# EAGLE design FT232_USB_UART_power (EAGLE 8.2.0)
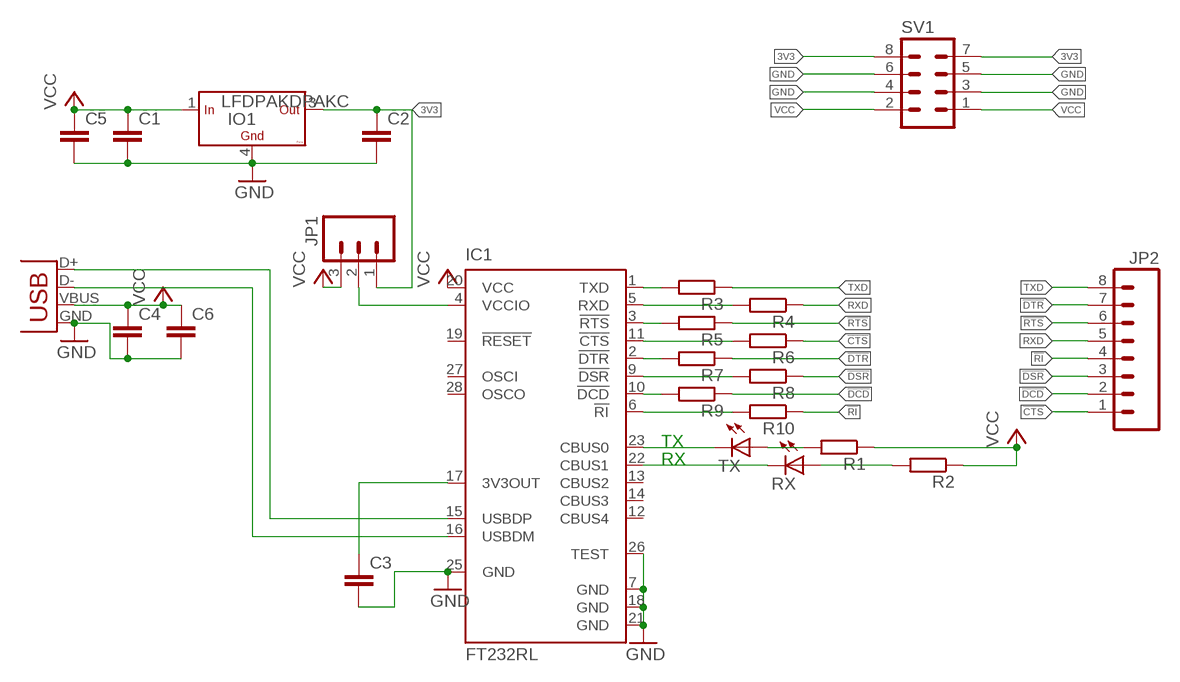
[diagram p0: schematic, sheet 1]

## Parts
C1  C-EUC0805  [C0805]
C2  C-EUC0805  [C0805]
C3  C-EUC0805  [C0805]
C4  C-EUC0805  [C0805]
C5  C-EUC0805  [C0805]
C6  C-EUC0805  [C0805]
IC1  FT232RL  [SSOP28]
IO1  LFDPAKDPAKC  [DPAK]
JP1  M03LONGPADS  [1X03_LONGPADS]
JP2  M08LONGPADS  [1X08_LONGPADS]
R1  R-EU_M0805  [M0805]
R2  R-EU_M0805  [M0805]
R3  R-EU_M0805  [M0805]
R4  R-EU_M0805  [M0805]
R5  R-EU_M0805  [M0805]
R6  R-EU_M0805  [M0805]
R7  R-EU_M0805  [M0805]
R8  R-EU_M0805  [M0805]
R9  R-EU_M0805  [M0805]
R10  R-EU_M0805  [M0805]
RX  LEDSML0805  [SML0805]
SV1  MA04-2  [MA04-2]
TX  LEDSML0805  [SML0805]
X1  USB-SMD-NS  [USB-MINIB-NOSTOP]

## Nets
3V3: C2.1 IO1.3(OUT) JP1.1 SV1.7 SV1.8
!CTS: JP2.1 R6.1
!DCD: JP2.2 R9.1
!DSR: JP2.3 R8.1
!DTR: JP2.7 R7.1
!RI: JP2.4 R10.1
!RTS: JP2.6 R5.1
GND: C1.2 C2.2 C3.2 C4.2 C5.2 C6.2 IC1.7(GND) IC1.18(GND) IC1.21(GND) IC1.25(GND) IC1.26(TEST) IO1.4(GND) SV1.3 SV1.4 SV1.5 SV1.6 X1.GND
N$1: IC1.15(USBDP) X1.D+
N$2: IC1.16(USBDM) X1.D-
N$3: IC1.23(CBUS0) TX.C
N$4: R1.2 TX.A
N$6: C3.1 IC1.17(3V3OUT)
N$7: IC1.4(VCCIO) JP1.2
N$8: R2.2 RX.A
N$9: IC1.22(CBUS1) RX.C
N$10: IC1.1(TXD) R3.2
N$11: IC1.5(RXD) R4.2
N$12: IC1.3(!RTS) R5.2
N$13: IC1.11(!CTS) R6.2
N$14: IC1.2(!DTR) R7.2
N$15: IC1.9(!DSR) R8.2
N$16: IC1.10(!DCD) R9.2
N$17: IC1.6(!RI) R10.2
RXD: JP2.5 R4.1
TXD: JP2.8 R3.1
VCC: C1.1 C4.1 C5.1 C6.1 IC1.20(VCC) IO1.1(IN) JP1.3 R1.1 R2.1 SV1.1 SV1.2 X1.VBUS
Unconnected: IC1.12(CBUS4) IC1.13(CBUS2) IC1.14(CBUS3) IC1.19(!RESET) IC1.27(OSCI) IC1.28(OSCO)

## Notes on the sheet
- TX
- RX

## Library data of the parts
C1-C6 = rcl:C-EU: CAPACITOR, European symbol
IC1 = ftdichip:FT232R: Source: http://www.ftdichip.com/Documents/DataSheets/DS_FT232R_v104.pdf; MPN: FT232RL; OC_FARNELL: 1146032; OC_NEWARK: 91K9918
IO1 = #PaJa_30:LF??C: LF??C - stabilizátory low-drop výstup dle typu 1,25 - 12V
JP1 = SparkFun:M03: Header 3 Standard 3-pin 0.1" header. Use with straight break away headers (SKU : PRT-00116), right angle break away headers (PRT-00553), swiss pins (PRT-00743), machine pins (PRT-00117), and female headers (PRT-00115). Molex polarized connector foot print use with SKU : PRT-08232 with associated crimp pins and housings.
JP2 = SparkFun:M08: Header 8 Standard 8-pin 0.1" header. Use with straight break away headers (SKU : PRT-00116), right angle break away headers (PRT-00553), swiss pins (PRT-00743), machine pins (PRT-00117), and female headers (PRT-00115).
R1-R10 = rcl:R-EU_: RESISTOR, European symbol
RX TX = led:LED: LED OSRAM: - CHIPLED LG R971, LG N971, LY N971, LG Q971, LY Q971, LO R971, LY R971 LH N974, LH R974 LS Q976, LO Q976, LY Q976 LO Q996 - Hyper CHIPLED LW Q18S LB Q993, LB Q99A, LB R99A - SideLED LS A670, LO A670, LY A670, LG A670, LP A670 LB A673, LV A673, LT A673, LW A673 LH A674 LY A675 LS A676, LA A676, LO A676, LY A676, LW A676 LS A679, LY A679, LG A679 - Hyper Micro SIDELED® LS Y876, LA Y876, LO Y876, LY Y876 LT Y87S - SmartLED LW L88C, LW L88S LB L89C, LB L89S, LG L890 LS L89K, LO L89K, LY L89K LS L896, LA L896, LO L896, LY L896 - TOPLED LS T670, LO T670, LY T670, LG T670, LP T670 LSG T670, LSP T670, LSY T670, LOP T670, LYG T670 LG T671, LOG T671, LSG T671 LB T673, LV T673, LT T673, LW T673 LH T674 LS T676, LA T676, LO T676, LY T676, LB T676, LH T676, LSB T676, LW T676 LB T67C, LV T67C, LT T67C, LS T67K, LO T67K, LY T67K, LW E67C LS E67B, LA E67B, LO E67B, LY E67B, LB E67C, LV E67C, LT E67C LW T67C LS T679, LY T679, LG T679 LS T770, LO T770, LY T770, LG T770, LP T770 LB T773, LV T773, LT T773, LW T773 LH T774 LS E675, LA E675, LY E675, LS T675 LS T776, LA T776, LO T776, LY T776, LB T776 LHGB T686 LT T68C, LB T68C - Hyper Mini TOPLED® LB M676 - Mini TOPLED Santana® LG M470 LS M47K, LO M47K, LY M47K Source: http://www.osram.convergy.de LUXEON: - LUMILED® LXK2-PW12-R00, LXK2-PW12-S00, LXK2-PW14-U00, LXK2-PW14-V00 LXK2-PM12-R00, LXK2-PM12-S00, LXK2-PM14-U00 LXK2-PE12-Q00, LXK2-PE12-R00, LXK2-PE12-S00, LXK2-PE14-T00, LXK2-PE14-U00 LXK2-PB12-K00, LXK2-PB12-L00, LXK2-PB12-M00, LXK2-PB14-N00, LXK2-PB14-P00, LXK2-PB14-Q00 LXK2-PR12-L00, LXK2-PR12-M00, LXK2-PR14-Q00, LXK2-PR14-R00 LXK2-PD12-Q00, LXK2-PD12-R00, LXK2-PD12-S00 LXK2-PH12-R00, LXK2-PH12-S00 LXK2-PL12-P00, LXK2-PL12-Q00, LXK2-PL12-R00 Source: www.luxeon.com KINGBRIGHT: KA-3528ASYC Source: www.kingbright.com
SV1 = con-lstb:MA04-2: PIN HEADER; OC_FARNELL: unknown; OC_NEWARK: unknown
X1 = SparkFun:USB: USB Connectors USB-B-PTH is fully proven SKU : PRT-00139 USB-miniB is fully proven SKU : PRT-00587 USB-A-PCB is untested. USB-A-H is throughly reviewed, but untested. Spark Fun Electronics SKU : PRT-00437 USB-B-SMT is throughly reviewed, but untested. Needs silkscreen touching up. USB-A-S has not been used/tested USB-MB-H has not been used/tested

## Board
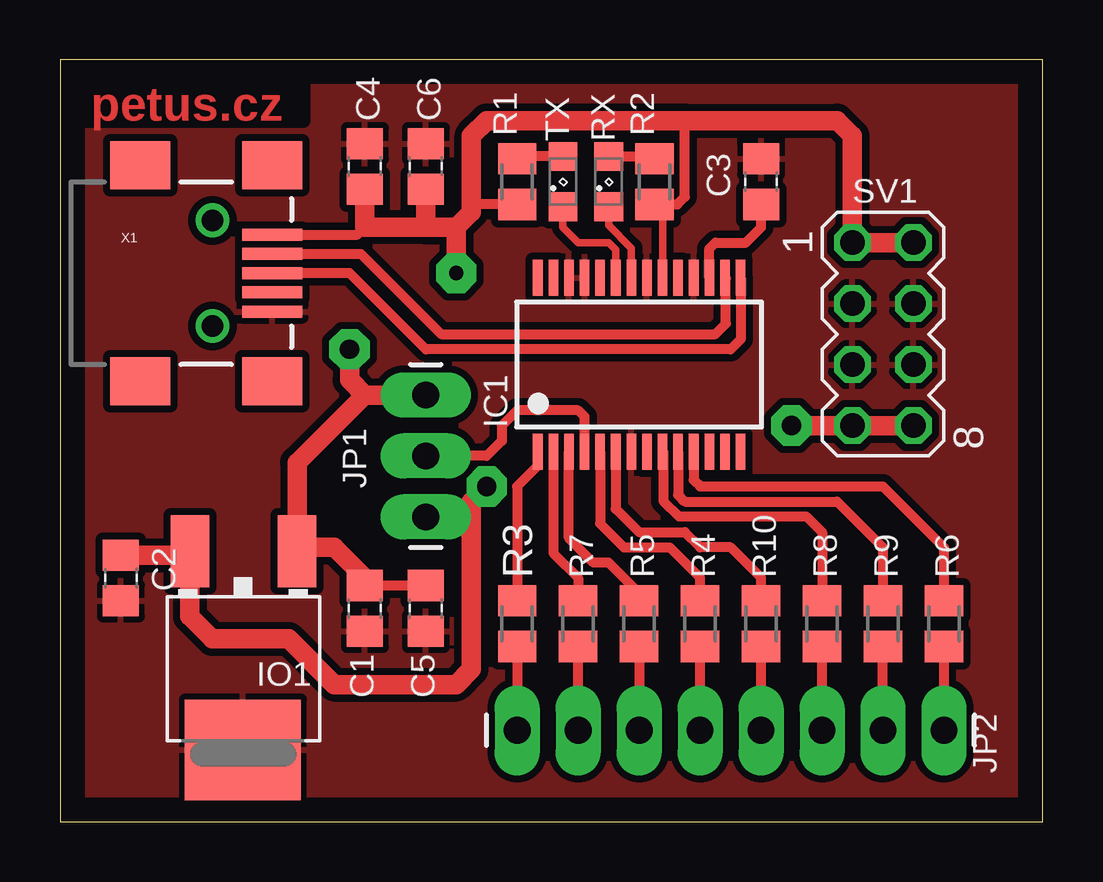
[diagram p1: board, top side]
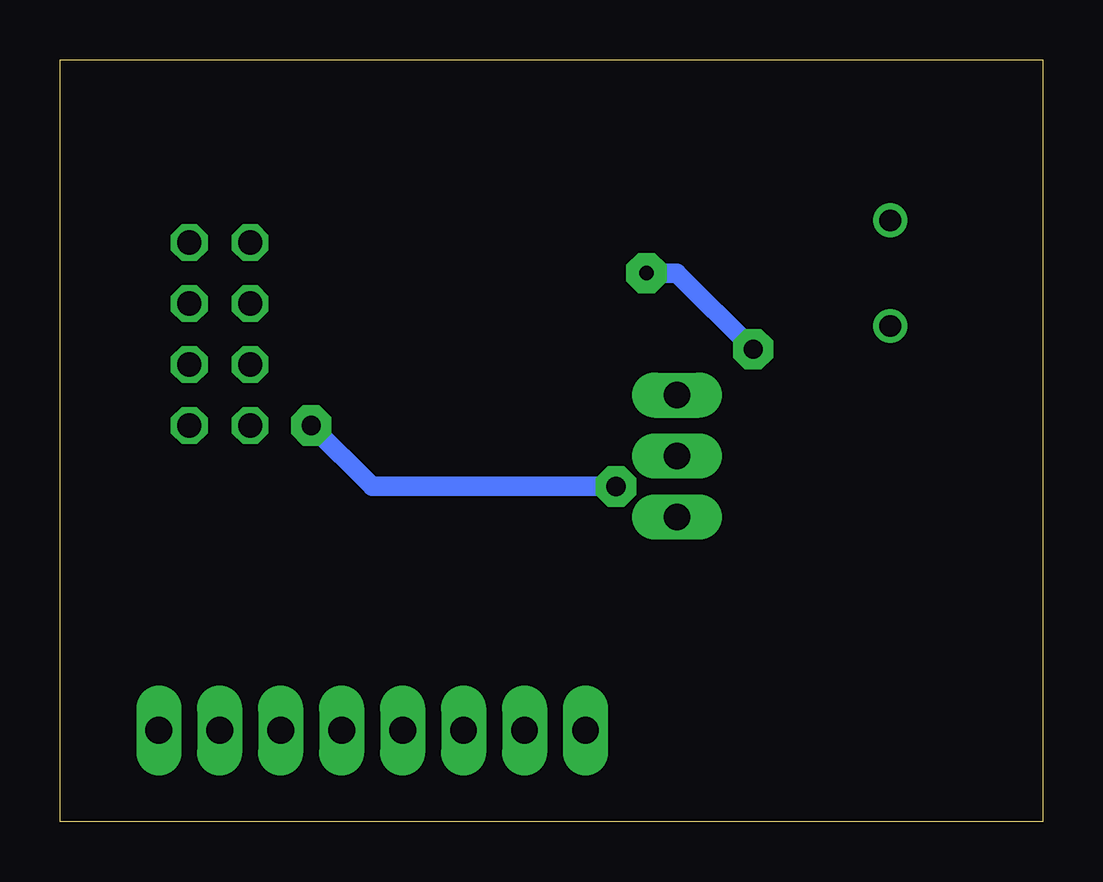
[diagram p2: board, bottom side, seen from below]

Size 40.95 x 31.74 mm. Coordinates in mm from the lower left corner, seen from the top.
Outline: 0,0 40.95,0 40.95,31.74 0,31.74 0,0
Copper layers (1*2*3*16): Top 0.035mm / dielectric 1.5mm / layer 2 0.035mm / dielectric 0.15mm / layer 3 0.035mm / dielectric 0.2mm / Bottom 0.035mm
Design rules "default *": minimum track width 10mil, minimum drill 24mil, track to track 8mil, track to pad 8mil, pad to pad 8mil, via to via 8mil, smd to smd 8mil, copper to edge 40mil, drill to drill 8mil, minimum pad ring 10mil, minimum via ring 8mil, stop-mask expansion 4mil, vias tented up to drill 0mil, thermal gap 10mil

### Footprints (pad centres in the part's own frame; a part is rotated, then mirrored left to right if it is on the bottom)
C0805 = smd 1.3 x 1.5: 1 -0.95,0; 2 0.95,0
SSOP28 = smd 0.4 x 1.5: 1 -4.225,-3.625; 2 -3.575,-3.625; 3 -2.925,-3.625; 4 -2.275,-3.625; 5 -1.625,-3.625; 6 -0.975,-3.625; 7 -0.325,-3.625; 8 0.325,-3.625; 9 0.975,-3.625; 10 1.625,-3.625; 11 2.275,-3.625; 12 2.925,-3.625; 13 3.575,-3.625; 14 4.225,-3.625; 15 4.225,3.625; 16 3.575,3.625; 17 2.925,3.625; 18 2.275,3.625; 19 1.625,3.625; 20 0.975,3.625; 21 0.325,3.625; 22 -0.325,3.625; 23 -0.975,3.625; 24 -1.625,3.625; 25 -2.275,3.625; 26 -2.925,3.625; 27 -3.575,3.625; 28 -4.225,3.625
DPAK = smd 1.6 x 2.997: 1 -2.261,-4.928; 3 2.21,-4.928 | smd 4.826 x 4.191: 4 0,3.353
1X03_LONGPADS = drill 1.118 pad 1.88 long: 1 0,0; 2 2.54,0; 3 5.08,0
1X08_LONGPADS = drill 1.118 pad 1.88 long: 1 0,0; 2 2.54,0; 3 5.08,0; 4 7.62,0; 5 10.16,0; 6 12.7,0; 7 15.24,0; 8 17.78,0
M0805 = smd 1.3 x 1.6: 1 -0.95,0; 2 0.95,0
SML0805 = smd 1.2 x 1.2: A 1.05,0; C -1.05,0
MA04-2 = drill 1.016 octagon: 1 -3.81,-1.27; 2 -3.81,1.27; 3 -1.27,-1.27; 4 -1.27,1.27; 5 1.27,-1.27; 6 1.27,1.27; 7 3.81,-1.27; 8 3.81,1.27
USB-MINIB-NOSTOP = smd 2.5 x 0.5: D+ 2.5,0; D- 2.5,0.8; GND 2.5,-1.6; ID 2.5,-0.8; VBUS 2.5,1.6 | smd 2.5 x 2: G1 -3,-4.5; G2 -3,4.5; G3 2.5,4.5; G4 2.5,-4.5 | drill 0.9 pad 0.8: H1 0,2.2 | drill 0.9 pad 0.787: H2 0,-2.2

### Placement (x,y rotation side)
C1  12.7,8.89 270 top
C2  2.54,10.16 270 top
C3  29.21,26.67 90 top
C4  12.7,27.3 90 top
C5  15.24,8.89 270 top
C6  15.24,27.3 90 top
IC1  24.13,19.05 0 top
IO1  LFDPAK?C  [DPAK]  7.62,6.35 180 top
JP1  15.24,12.7 90 top
JP2  36.83,3.81 180 top
R1  19.05,26.67 90 top
R2  24.77,26.67 90 top
R3  19.05,8.26 90 top
R4  26.67,8.26 90 top
R5  24.13,8.26 90 top
R6  36.83,8.26 90 top
R7  21.59,8.26 90 top
R8  31.75,8.26 90 top
R9  34.29,8.26 90 top
R10  29.21,8.26 90 top
RX  22.86,26.67 90 top
SV1  34.29,20.32 270 top
TX  20.95,26.67 90 top
X1  6.35,22.86 0 top

### Tracks (layer width: path | path; a pad name or v marks a point on that pad's centre or on a via)
3V3  (via drill 0.8 pad 1.68)
  Top 0.813: C2.1 5.24,11.11 IO1.3 5.41,8.56 6.35,7.62 9.53,7.62 11.43,5.71 16.51,5.71 17.14,6.35 17.14,12.06 | 17.14,12.06 16.51,12.7 JP1.1 | 17.14,12.06 17.14,13.34 v17.78,13.97 | v30.48,16.51 SV1.7 SV1.8
  Bottom 0.813: v17.78,13.97 27.94,13.97 v30.48,16.51
!CTS
  Top 0.406: R6.1 JP2.1
!DCD
  Top 0.406: JP2.2 R9.1
!DSR
  Top 0.406: JP2.3 R8.1
!DTR
  Top 0.406: JP2.7 R7.1
!RI
  Top 0.406: JP2.4 R10.1
!RTS
  Top 0.406: R5.1 JP2.6
GND
  pour Top (isolate 0.305): 0,31.75 40.64,31.75 40.64,0 0,0
N$1
  Top 0.406: IC1.15 28.36,20.1 27.94,19.68 15.24,19.68 12.06,22.86 X1.D+
N$2
  Top 0.406: X1.D- 12.54,23.66 15.88,20.32 27.3,20.32 27.75,20.76 27.75,22.64 IC1.16
N$3
  Top 0.305: IC1.23 23.16,23.84 22.86,24.13 21.59,24.13 20.95,24.77 TX.C
N$4
  Top 0.406: TX.A 19.15,27.72 R1.2
N$6
  Top 0.406: IC1.17 27.05,23.88 27.3,24.13 28.57,24.13 29.21,24.77 C3.1
N$7
  Top 0.406: IC1.4 21.86,16.88 21.59,17.14 19.05,17.14 18.41,16.51 18.41,15.88 17.78,15.24 JP1.2
N$8
  Top 0.406: RX.A 24.66,27.72 R2.2
N$9
  Top 0.305: RX.C 22.86,24.85 23.8,23.9 IC1.22
N$10
  Top 0.406: IC1.1 19.91,14.82 19.05,13.97 R3.2
N$11
  Top 0.406: R4.2 26.67,10.16 25.4,11.43 23.5,11.43 22.5,12.42 IC1.5
N$12
  Top 0.406: R5.2 24.13,9.53 22.86,10.79 22.23,10.79 21.2,11.81 IC1.3
N$13
  Top 0.406: IC1.11 26.41,14.23 26.67,13.97 34.29,13.97 36.83,11.43 R6.2
N$14
  Top 0.406: IC1.2 20.55,11.2 21.59,10.16 R7.2
N$15
  Top 0.406: IC1.9 25.14,15.38 25.14,13.36 25.78,12.72 31.09,12.72 31.75,12.06 R8.2
N$16
  Top 0.406: IC1.10 25.75,13.62 26.04,13.34 32.38,13.34 34.29,11.43 R9.2
N$17
  Top 0.406: R10.2 29.21,10.16 27.94,11.43 26.67,11.43 26.04,12.06 24.13,12.06 23.16,13.04 IC1.6
RXD
  Top 0.406: JP2.5 R4.1
TXD
  Top 0.406: R3.1 JP2.8
VCC  (via drill 0.6 pad 1.68, 0.8 pad 1.68)
  Top 0.305: IC1.20 25.11,25.38 R2.1
  Top 0.406: C5.1 C1.1 | X1.VBUS 12.39,24.46 12.7,24.77 | R1.1 17.46,25.72 17.14,25.4 | R2.1 25.72,25.72 26.04,26.04 26.04,29.21
  Top 0.813: C1.1 12.7,10.16 11.43,11.43 10.03,11.43 IO1.1 9.88,14.96 12.7,17.78 | 12.7,17.78 JP1.3 | SV1.2 SV1.1 33.02,28.57 32.38,29.21 26.04,29.21 17.78,29.21 17.14,28.57 17.14,25.4 16.51,24.77 | v12.06,19.68 12.06,18.41 12.7,17.78 | 15.24,24.77 12.7,24.77 C4.1 | 15.24,24.77 16.51,24.77 | C6.1 15.24,24.77 | 16.51,24.77 v16.51,22.86
  Bottom 0.813: v16.51,22.86 15.24,22.86 v12.06,19.68

### Text on the board
Top: petus.cz